# EAGLE design MD201x_2019-02-01 (EAGLE 9.3.0)

## Sheet 1 of 4
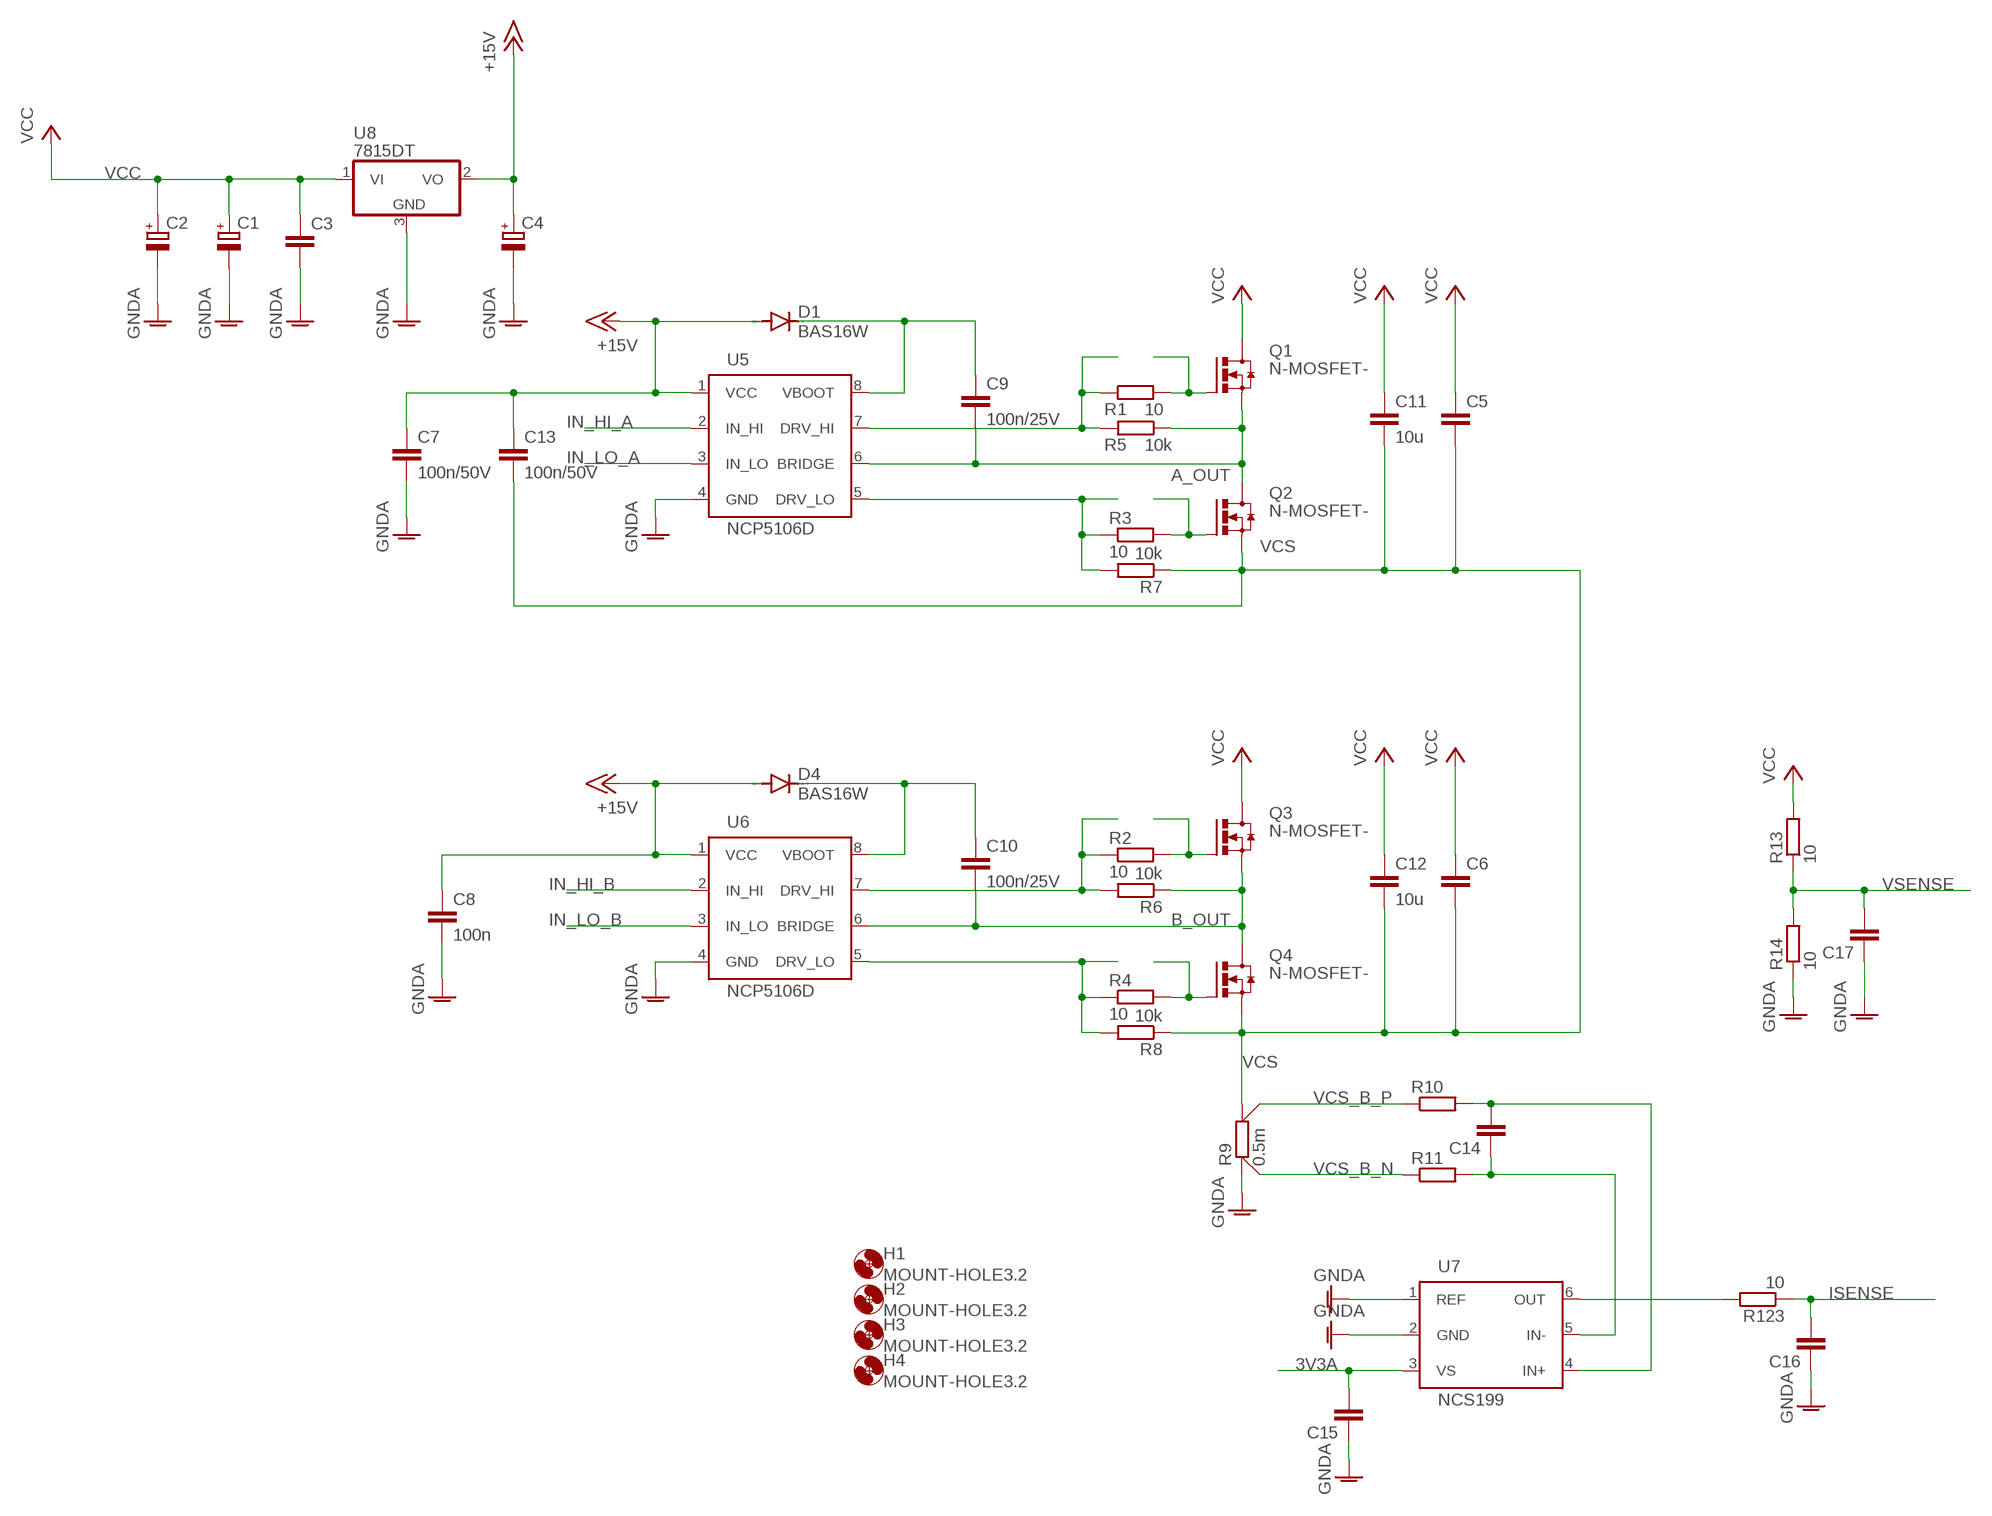
[diagram p0: schematic, sheet 1]

### Parts
C1  CPOL-EUE5-10.5  [E5-10,5]
C2  CPOL-EUE5-10.5  [E5-10,5]
C3  C-EUC0603  [C0603]
C4  CPOL-EUE2.5-5  [E2,5-5]
C5  C-EUC0603  [C0603]
C6  C-EUC0603  [C0603]
C7  100n/50V  C-EUC0603  [C0603]
C8  100n  C-EUC0603  [C0603]
C9  100n/25V  C-EUC0603  [C0603]
C10  100n/25V  C-EUC0603  [C0603]
C11  10u  C-EUC1210  [C1210]
C12  10u  C-EUC1210  [C1210]
C13  100n/50V  C-EUC0603  [C0603]
C14  C-EUC0603  [C0603]
C15  C-EUC0603  [C0603]
C16  C-EUC0603  [C0603]
C17  C-EUC0603  [C0603]
D1  BAS16W  DIODE-SOD323-R  [SOD323-R]
D4  BAS16W  DIODE-SOD323-R  [SOD323-R]
H1  MOUNT-HOLE3.2  [3,2]
H2  MOUNT-HOLE3.2  [3,2]
H3  MOUNT-HOLE3.2  [3,2]
H4  MOUNT-HOLE3.2  [3,2]
Q1  N-MOSFET-  [SOT669]
Q2  N-MOSFET-  [SOT669]
Q3  N-MOSFET-  [SOT669]
Q4  N-MOSFET-  [SOT669]
R1  10  R-EU_R0603  [R0603]
R2  10  R-EU_R0603  [R0603]
R3  10  R-EU_R0603  [R0603]
R4  10  R-EU_R0603  [R0603]
R5  10k  R-EU_R0603  [R0603]
R6  10k  R-EU_R0603  [R0603]
R7  10k  R-EU_R0603  [R0603]
R8  10k  R-EU_R0603  [R0603]
R9  0.5m  CSS2H-2512  [CSS2H-2512]
R10  R-EU_R0603  [R0603]
R11  R-EU_R0603  [R0603]
R13  10  R-EU_R0603  [R0603]
R14  10  R-EU_R0603  [R0603]
R123  10  R-EU_R0603  [R0603]
U5  NCP5106D  [SOIC127P600X175-8]
U6  NCP5106D  [SOIC127P600X175-8]
U7  NCS199  [SOT65P210X110-6]
U8  7815DT  [TO252]

### Nets
3V3A: C15.2 U7.3(VS) ; also sheet 3
+15V: C4.+ C7.1 C8.1 C13.1 D1.A D4.A U5.1(VCC) U6.1(VCC) U8.2(VO) ; also sheet 4
A_OUT: C9.2 Q1.1(SOURCE) Q1.2(SOURCE) Q1.3(SOURCE) Q2.5(DRAIN) R5.1 U5.6(BRIDGE)
B_OUT: C10.2 Q3.1(SOURCE) Q3.2(SOURCE) Q3.3(SOURCE) Q4.5(DRAIN) R6.1 U6.6(BRIDGE)
GNDA: C1.- C2.- C3.2 C4.- C7.2 C8.2 C15.1 C16.1 C17.1 R9.1$1 R9.1$2 R14.1 U5.4(GND) U6.4(GND) U7.1(REF) U7.2(GND) U8.3(GND) ; also sheet 2,3,4
IN_HI_A: U5.2(IN_HI) ; also sheet 3
IN_HI_B: U6.2(IN_HI) ; also sheet 3
IN_LO_A: U5.3(IN_LO) ; also sheet 3
IN_LO_B: U6.3(IN_LO) ; also sheet 3
ISENSE: C16.2 R123.1 ; also sheet 3
N$1: R1.1 R5.2 U5.7(DRV_HI)
N$2: R2.1 R6.2 U6.7(DRV_HI)
N$4: Q1.4(GATE) R1.2
N$5: R4.1 R8.2 U6.5(DRV_LO)
N$6: R123.2 U7.6(OUT)
N$11: R3.1 R7.2 U5.5(DRV_LO)
N$13: Q3.4(GATE) R2.2
N$36: C14.2 R10.2 U7.4(IN+)
N$37: C14.1 R11.2 U7.5(IN-)
N$61: Q2.4(GATE) R3.2
N$64: Q4.4(GATE) R4.2
N$67: C10.1 D4.C U6.8(VBOOT)
N$73: C9.1 D1.C U5.8(VBOOT)
VCC: C1.+ C2.+ C3.1 C5.1 C6.1 C11.1 C12.1 Q1.5(DRAIN) Q3.5(DRAIN) R13.2 U8.1(VI)
VCS: C5.2 C6.2 C11.2 C12.2 C13.2 Q2.1(SOURCE) Q2.2(SOURCE) Q2.3(SOURCE) Q4.1(SOURCE) Q4.2(SOURCE) Q4.3(SOURCE) R7.1 R8.1 R9.2$1 R9.2$2
VCS_B_N: R9.1S R11.1
VCS_B_P: R9.2S R10.1
VSENSE: C17.2 R13.1 R14.2 ; also sheet 3

## Sheet 2 of 4
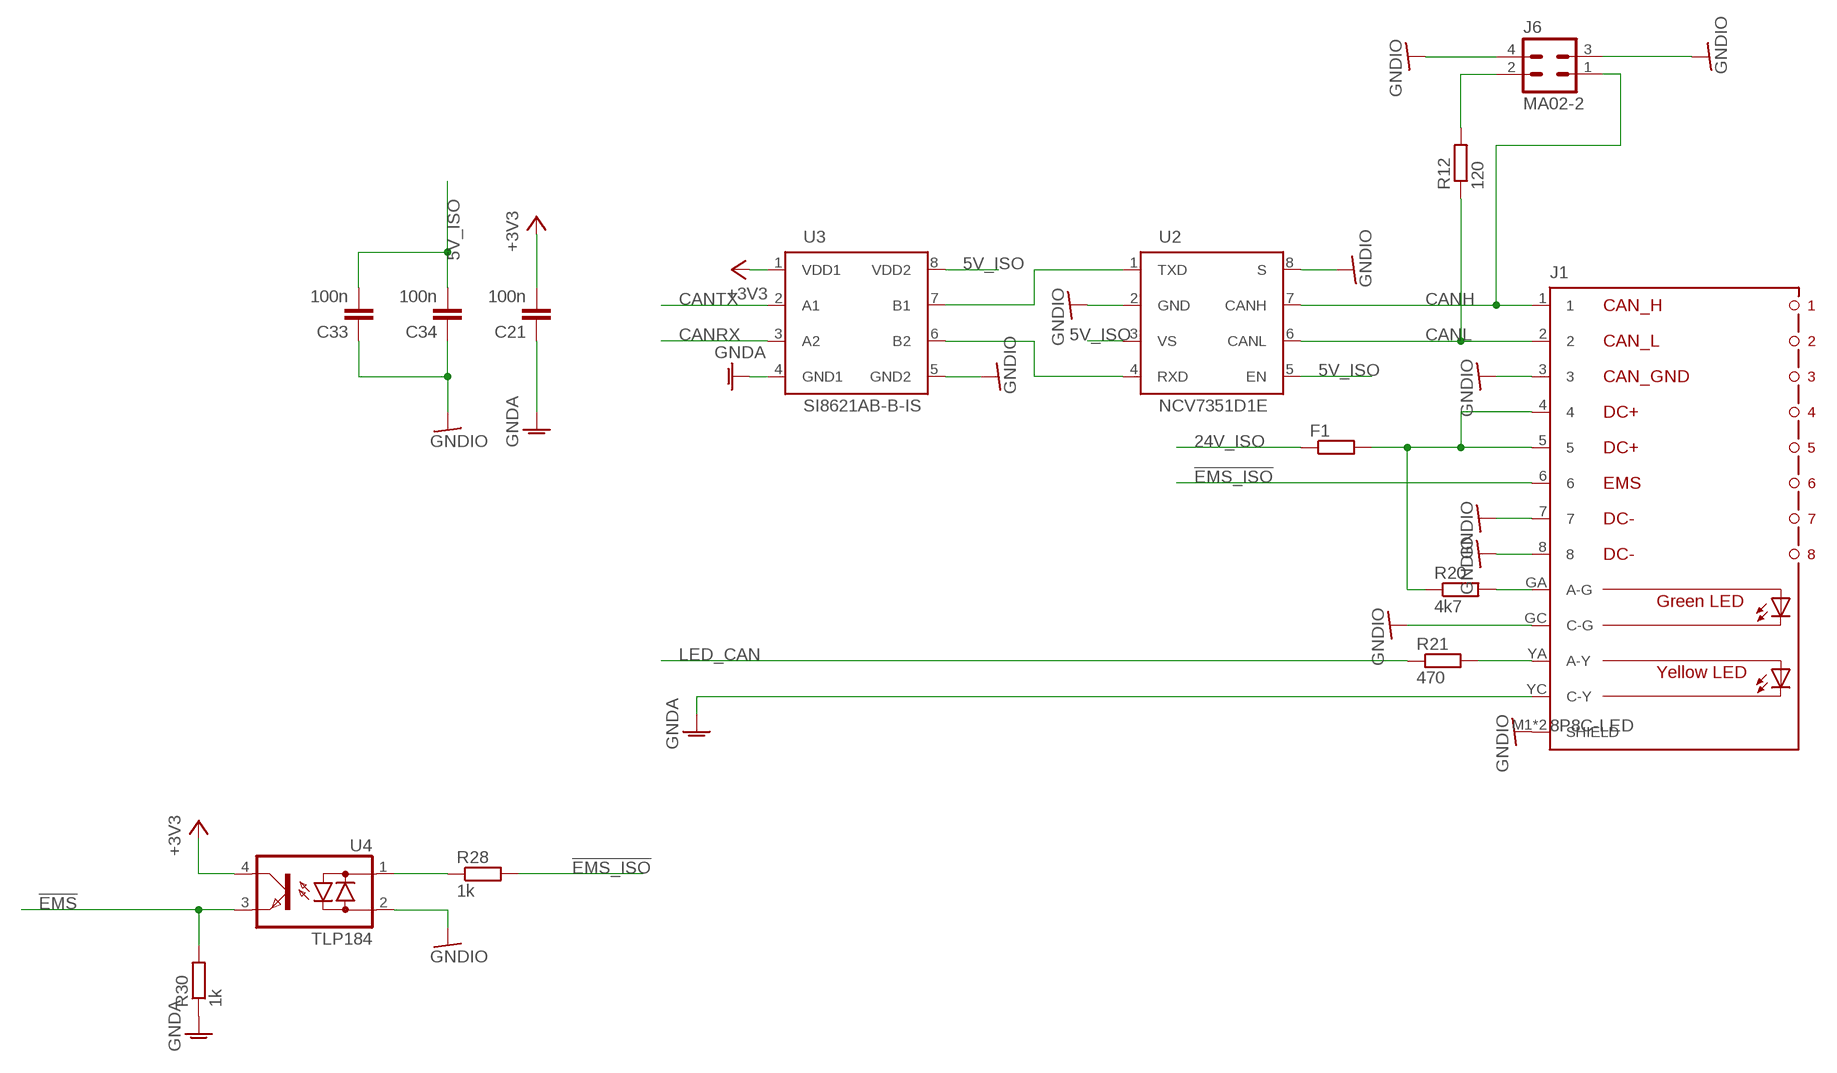
[diagram p1: schematic, sheet 2]

### Parts
C21  100n  C-EUC0603  [C0603]
C33  100n  C-EUC0805  [C0805]
C34  100n  C-EUC0603  [C0603]
F1  R-EU_R1206  [R1206]
J1  8P8C-LED  [8P8C-LED]
J6  MA02-2  [MA02-2W]
R12  120  R-EU_R0603  [R0603]
R20  4k7  R-EU_R0603  [R0603]
R21  470  R-EU_R0603  [R0603]
R28  1k  R-EU_R0603  [R0603]
R30  1k  R-EU_R0603  [R0603]
U2  NCV7351D1E  [SO08]
U3  SI8621AB-B-IS  [SO08]
U4  TLP184  [11-4M1S]

### Nets
5V_ISO: C33.2 C34.2 U2.3(VS) U2.5(EN) U3.8(VDD2) ; also sheet 4
24V_ISO: F1.1 ; also sheet 4
!EMS: R30.2 U4.3(E) ; also sheet 3
!EMS_ISO: J1.6 R28.2
+3V3: C21.2 U3.1(VDD1) U4.4(C) ; also sheet 3,4
CANH: J1.1 J6.1 U2.7(CANH)
CANL: J1.2 R12.1 U2.6(CANL)
CANRX: U3.3(A2) ; also sheet 3
CANTX: U3.2(A1) ; also sheet 3
GNDA: C21.1 J1.YC(C-Y) R30.1 U3.4(GND1) ; also sheet 1,3,4
GNDIO: C33.1 C34.1 J1.3 J1.7 J1.8 J1.GC(C-G) J1.M1(SHIELD) J1.M2(SHIELD) J6.3 J6.4 U2.2(GND) U2.8(S) U3.5(GND2) U4.2(AC2) ; also sheet 4
LED_CAN: R21.1 ; also sheet 3
N$8: F1.2 J1.4 J1.5 R20.1
N$9: J6.2 R12.2
N$18: J1.GA(A-G) R20.2
N$20: J1.YA(A-Y) R21.2
N$23: U2.1(TXD) U3.7(B1)
N$27: U2.4(RXD) U3.6(B2)
N$30: R28.1 U4.1(AC1)

## Sheet 3 of 4
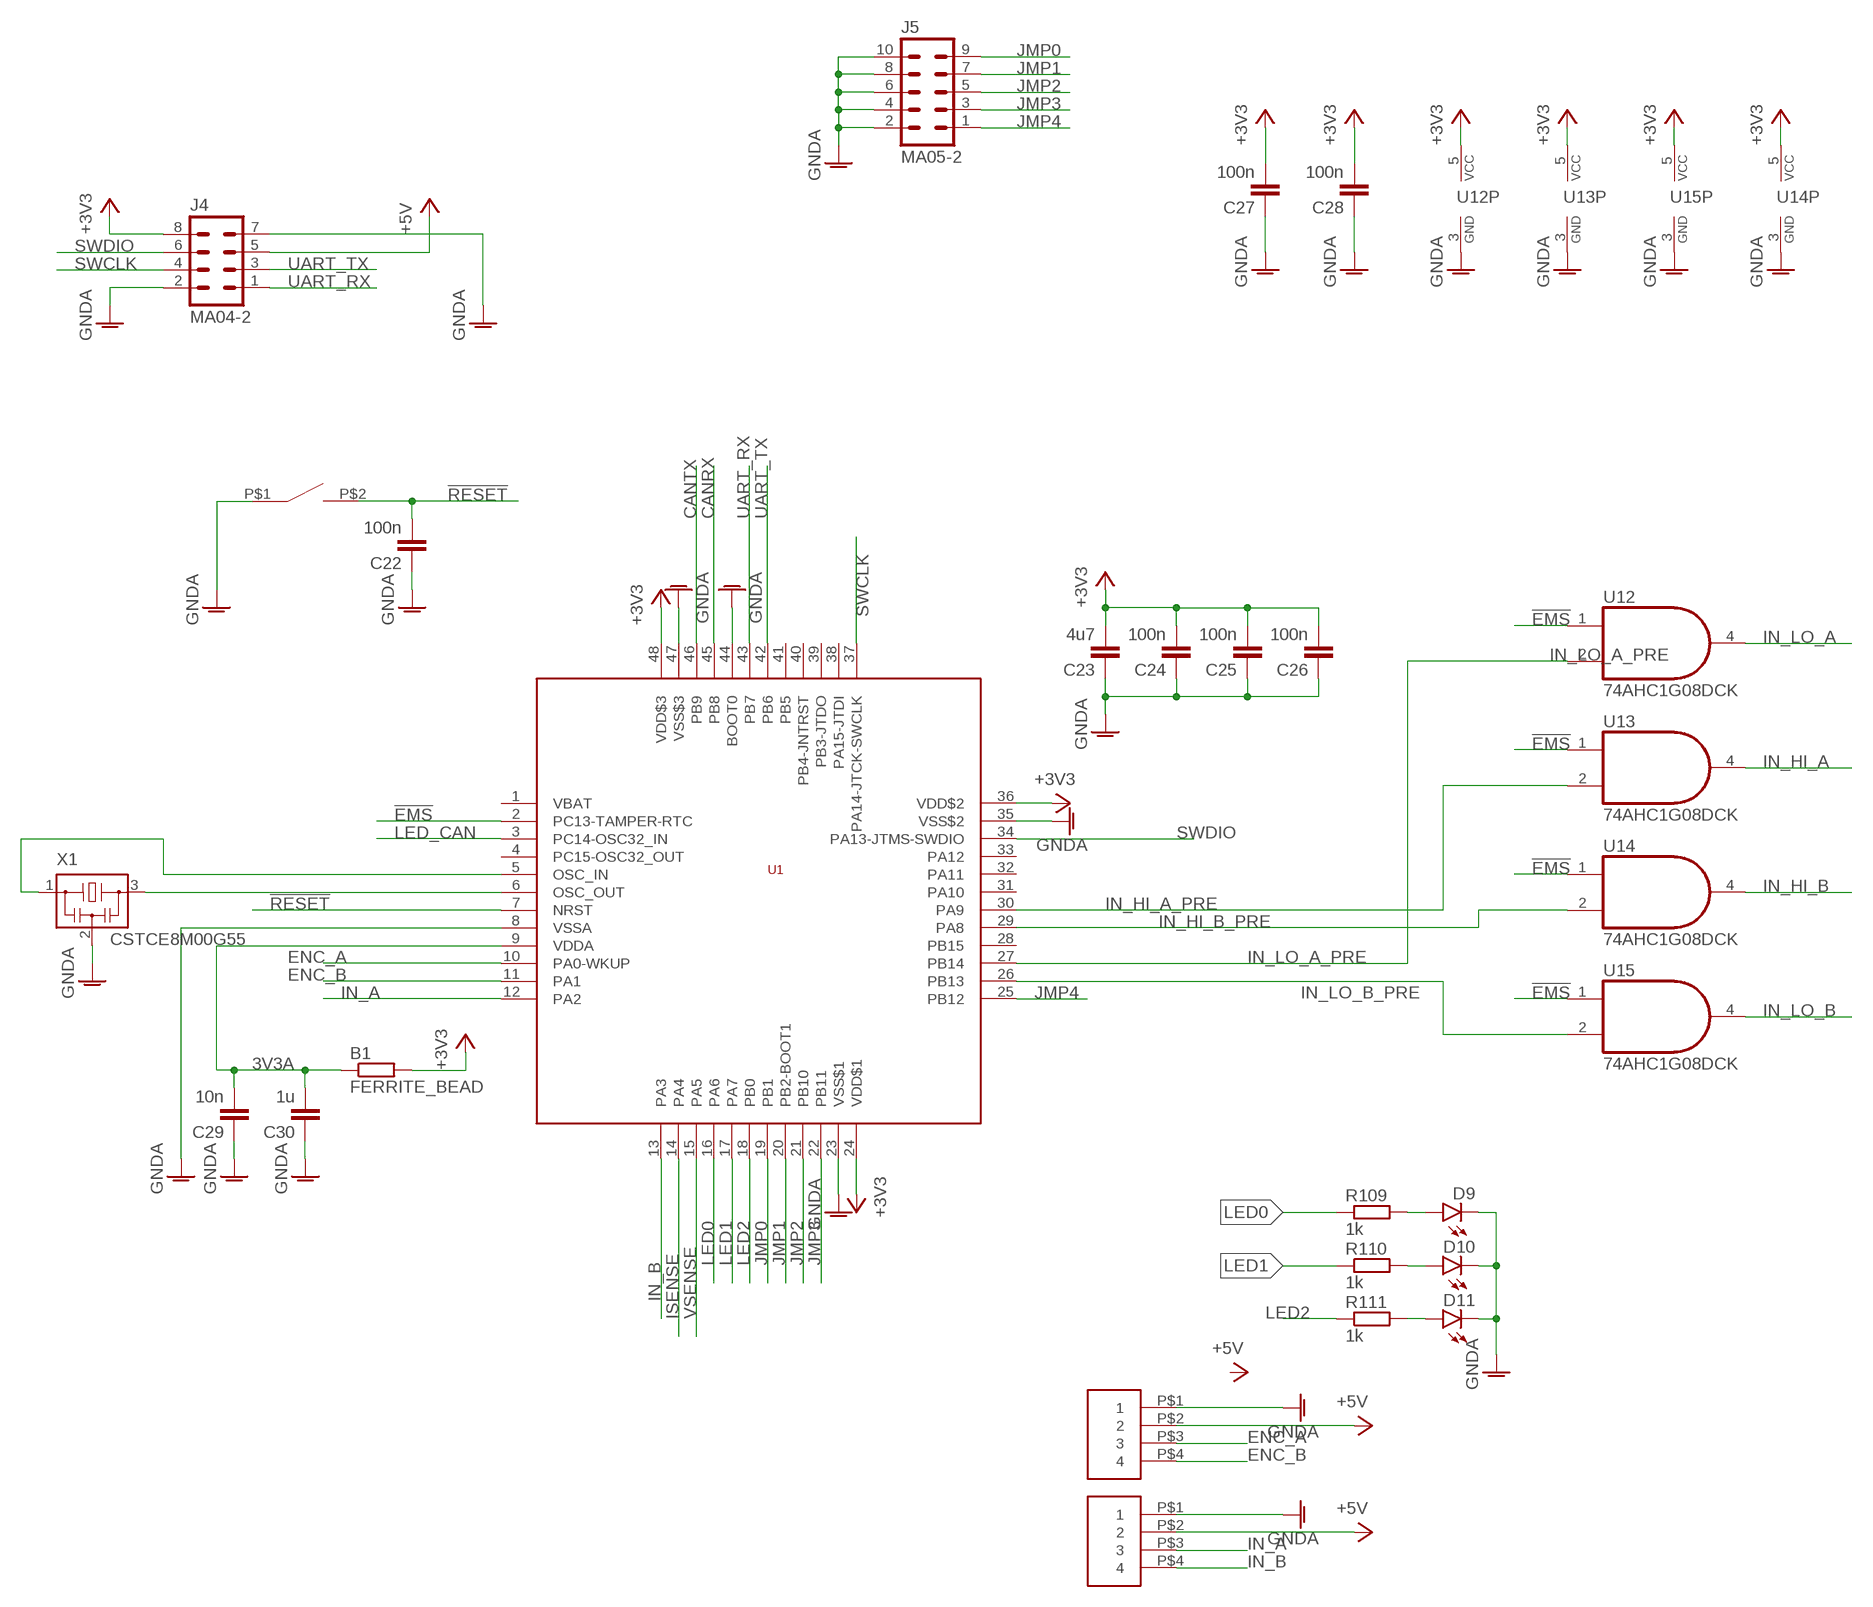
[diagram p2: schematic, sheet 3]

### Parts
B1  FERRITE_BEAD  R-EU_R0603  [R0603]
C22  100n  C-EUC0603  [C0603]
C23  4u7  C-EUC0805  [C0805]
C24  100n  C-EUC0603  [C0603]
C25  100n  C-EUC0603  [C0603]
C26  100n  C-EUC0603  [C0603]
C27  100n  C-EUC0603  [C0603]
C28  100n  C-EUC0603  [C0603]
C29  10n  C-EUC0603  [C0603]
C30  1u  C-EUC0603  [C0603]
D9  LEDCHIPLED_0805  [CHIPLED_0805]
D10  LEDCHIPLED_0805  [CHIPLED_0805]
D11  LEDCHIPLED_0805  [CHIPLED_0805]
J2  XH-4-SIDE  [CON-XH-4-SIDE]
J3  XH-4-SIDE  [CON-XH-4-SIDE]
J4  MA04-2  [MA04-2W]
J5  MA05-2  [MA05-2W]
R109  1k  R-EU_R0603  [R0603]
R110  1k  R-EU_R0603  [R0603]
R111  1k  R-EU_R0603  [R0603]
S1  SWITCH_TACTILETOP  [SWITCH_TACTILE_3X6]
U1  STM32F103C8  [LQFP48]
U12  74AHC1G08DCK  [SC70-5]
U13  74AHC1G08DCK  [SC70-5]
U14  74AHC1G08DCK  [SC70-5]
U15  74AHC1G08DCK  [SC70-5]
X1  CSTCE8M00G55  [CSTCE8M00G55]

### Nets
3V3A: B1.1 C29.2 C30.2 U1.9(VDDA) ; also sheet 1
!EMS: U1.2(PC13-TAMPER-RTC) U12.1(I0) U13.1(I0) U14.1(I0) U15.1(I0) ; also sheet 2
!RESET: C22.2 S1.P$2 U1.7(NRST)
+3V3: B1.2 C23.2 C24.2 C25.2 C26.2 C27.2 C28.2 J4.8 U1.24(VDD$1) U1.36(VDD$2) U1.48(VDD$3) U12.5(VCC) U13.5(VCC) U14.5(VCC) U15.5(VCC) ; also sheet 2,4
+5V: J2.P$2 J3.P$2 J4.5 ; also sheet 4
CANRX: U1.45(PB8) ; also sheet 2
CANTX: U1.46(PB9) ; also sheet 2
ENC_A: J2.P$3 U1.10(PA0-WKUP)
ENC_B: J2.P$4 U1.11(PA1)
GNDA: C22.1 C23.1 C24.1 C25.1 C26.1 C27.1 C28.1 C29.1 C30.1 D9.C D10.C D11.C J2.P$1 J3.P$1 J4.2 J4.7 J5.2 J5.4 J5.6 J5.8 J5.10 S1.P$1 U1.8(VSSA) U1.23(VSS$1) U1.35(VSS$2) U1.44(BOOT0) U1.47(VSS$3) U12.3(GND) U13.3(GND) U14.3(GND) U15.3(GND) X1.2 ; also sheet 1,2,4
IN_A: J3.P$3 U1.12(PA2)
IN_B: J3.P$4 U1.13(PA3)
IN_HI_A: U13.4(O) ; also sheet 1
IN_HI_A_PRE: U1.30(PA9) U13.2(I1)
IN_HI_B: U14.4(O) ; also sheet 1
IN_HI_B_PRE: U1.29(PA8) U14.2(I1)
IN_LO_A: U12.4(O) ; also sheet 1
IN_LO_A_PRE: U1.27(PB14) U12.2(I1)
IN_LO_B: U15.4(O) ; also sheet 1
IN_LO_B_PRE: U1.26(PB13) U15.2(I1)
ISENSE: U1.14(PA4) ; also sheet 1
JMP0: J5.9 U1.19(PB1)
JMP1: J5.7 U1.20(PB2-BOOT1)
JMP2: J5.5 U1.21(PB10)
JMP3: J5.3 U1.22(PB11)
JMP4: J5.1 U1.25(PB12)
LED0: R109.1 U1.16(PA6)
LED1: R110.1 U1.17(PA7)
LED2: R111.1 U1.18(PB0)
LED_CAN: U1.3(PC14-OSC32_IN) ; also sheet 2
N$3: D10.A R110.2
N$7: D9.A R109.2
N$10: U1.6(OSC_OUT) X1.3
N$19: U1.5(OSC_IN) X1.1
N$21: D11.A R111.2
SWCLK: J4.4 U1.37(PA14-JTCK-SWCLK)
SWDIO: J4.6 U1.34(PA13-JTMS-SWDIO)
UART_RX: J4.1 U1.43(PB7)
UART_TX: J4.3 U1.42(PB6)
VSENSE: U1.15(PA5) ; also sheet 1
Unconnected: U1.1(VBAT) U1.4(PC15-OSC32_OUT) U1.28(PB15) U1.31(PA10) U1.32(PA11) U1.33(PA12) U1.38(PA15-JTDI) U1.39(PB3-JTDO) U1.40(PB4-JNTRST) U1.41(PB5)

## Sheet 4 of 4
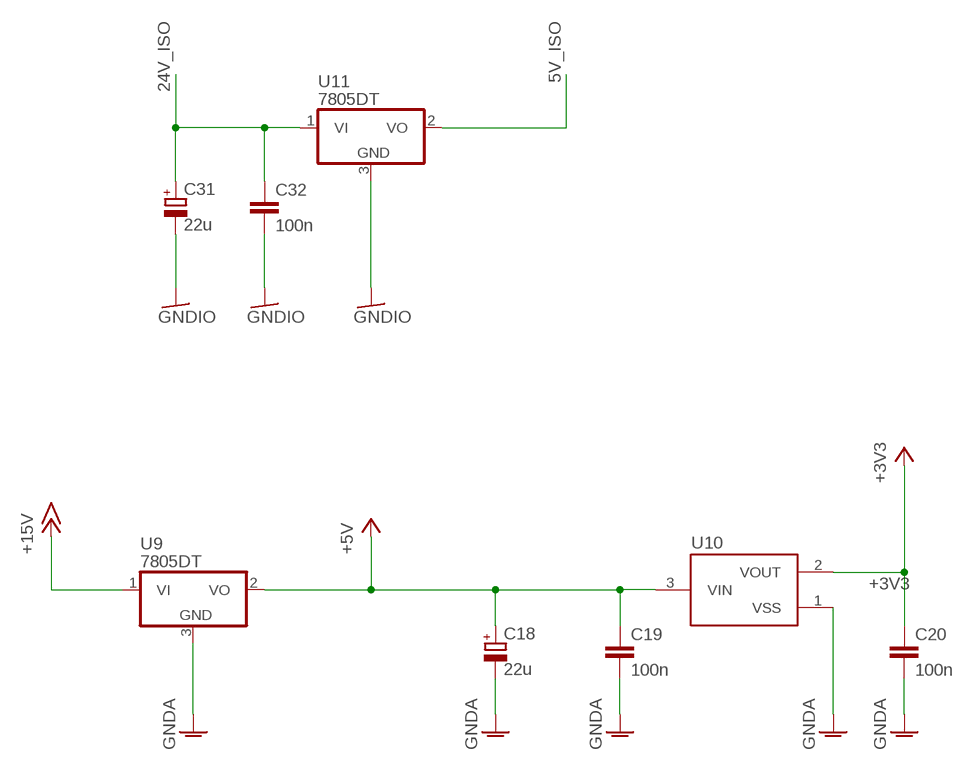
[diagram p3: schematic, sheet 4]

### Parts
C18  22u  CPOL-EUE2.5-5  [E2,5-5]
C19  100n  C-EUC0603  [C0603]
C20  100n  C-EUC0603  [C0603]
C31  22u  CPOL-EUE2.5-5  [E2,5-5]
C32  100n  C-EUC0603  [C0603]
U9  7805DT  [TO252]
U10  XC6206  [SOT95P240X110-3]
U11  7805DT  [TO252]

### Nets
5V_ISO: U11.2(VO) ; also sheet 2
24V_ISO: C31.+ C32.1 U11.1(VI) ; also sheet 2
+3V3: C20.1 U10.2(VOUT) ; also sheet 2,3
+5V: C18.+ C19.1 U9.2(VO) U10.3(VIN) ; also sheet 3
+15V: U9.1(VI) ; also sheet 1
GNDA: C18.- C19.2 C20.2 U9.3(GND) U10.1(VSS) ; also sheet 1,2,3
GNDIO: C31.- C32.2 U11.3(GND) ; also sheet 2

## Library data of the parts
B1 R1-R8 R13 R14 R109-R111 R123 = rcl:R-EU_: RESISTOR, European symbol
C1 C2 C4 C18 C31 = rcl:CPOL-EU: POLARIZED CAPACITOR, European symbol
C3 C5-C13 C19-C30 C32-C34 = rcl:C-EU: CAPACITOR, European symbol
C14-C17 = rcl:C-EU: CAPACITOR, European symbol; SPICEPREFIX: C
D1 D4 = diode:DIODE-: DIODE
D9-D11 = led:LED: LED OSRAM: - CHIPLED LG R971, LG N971, LY N971, LG Q971, LY Q971, LO R971, LY R971 LH N974, LH R974 LS Q976, LO Q976, LY Q976 LO Q996 - Hyper CHIPLED LW Q18S LB Q993, LB Q99A, LB R99A - SideLED LS A670, LO A670, LY A670, LG A670, LP A670 LB A673, LV A673, LT A673, LW A673 LH A674 LY A675 LS A676, LA A676, LO A676, LY A676, LW A676 LS A679, LY A679, LG A679 - Hyper Micro SIDELED® LS Y876, LA Y876, LO Y876, LY Y876 LT Y87S - SmartLED LW L88C, LW L88S LB L89C, LB L89S, LG L890 LS L89K, LO L89K, LY L89K LS L896, LA L896, LO L896, LY L896 - TOPLED LS T670, LO T670, LY T670, LG T670, LP T670 LSG T670, LSP T670, LSY T670, LOP T670, LYG T670 LG T671, LOG T671, LSG T671 LB T673, LV T673, LT T673, LW T673 LH T674 LS T676, LA T676, LO T676, LY T676, LB T676, LH T676, LSB T676, LW T676 LB T67C, LV T67C, LT T67C, LS T67K, LO T67K, LY T67K, LW E67C LS E67B, LA E67B, LO E67B, LY E67B, LB E67C, LV E67C, LT E67C LW T67C LS T679, LY T679, LG T679 LS T770, LO T770, LY T770, LG T770, LP T770 LB T773, LV T773, LT T773, LW T773 LH T774 LS E675, LA E675, LY E675, LS T675 LS T776, LA T776, LO T776, LY T776, LB T776 LHGB T686 LT T68C, LB T68C - Hyper Mini TOPLED® LB M676 - Mini TOPLED Santana® LG M470 LS M47K, LO M47K, LY M47K Source: http://www.osram.convergy.de LUXEON: - LUMILED® LXK2-PW12-R00, LXK2-PW12-S00, LXK2-PW14-U00, LXK2-PW14-V00 LXK2-PM12-R00, LXK2-PM12-S00, LXK2-PM14-U00 LXK2-PE12-Q00, LXK2-PE12-R00, LXK2-PE12-S00, LXK2-PE14-T00, LXK2-PE14-U00 LXK2-PB12-K00, LXK2-PB12-L00, LXK2-PB12-M00, LXK2-PB14-N00, LXK2-PB14-P00, LXK2-PB14-Q00 LXK2-PR12-L00, LXK2-PR12-M00, LXK2-PR14-Q00, LXK2-PR14-R00 LXK2-PD12-Q00, LXK2-PD12-R00, LXK2-PD12-S00 LXK2-PH12-R00, LXK2-PH12-S00 LXK2-PL12-P00, LXK2-PL12-Q00, LXK2-PL12-R00 Source: www.luxeon.com KINGBRIGHT: KA-3528ASYC Source: www.kingbright.com
F1 R10-R12 R20 R21 R28 R30 = rcl:R-EU_: RESISTOR, European symbol; SPICEPREFIX: R
H1-H4 = holes:MOUNT-HOLE: MOUNTING HOLE with drill center marker
J1 = con-rj45:8P8C-LED: generic 8P8C connector with two LED's; OC_FARNELL: unknown; OC_NEWARK: unknown
J2 J3 = con-xh:XH-4-SIDE
J4 = con-headers:MA04-2
J5 = con-headers:MA05-2
J6 = con-headers:MA02-2
Q1-Q4 = nexperia:N-MOSFET-*
R9 = r_shunt:CSS2H-2512: Bourns Model CSS2H-2512 Series Current Sense Resistor <https://www.bourns.com/docs/Product-Datasheets/css2h-2512.pdf>
S1 = switch-tactile:SWITCH_TACTILE
U1 = stm32_mcu:STM32F103C8: STMicroelectronics STM32F103C8 Mainstream Performance line, ARM Cortex-M3 MCU with 64 Kbytes Flash, 72 MHz CPU, motor control, USB and CAN references: datasheet <https://www.st.com/resource/en/datasheet/stm32f103c8.pdf> product page <https://www.st.com/ja/microcontrollers/stm32f103c8.html>
U2 = on-semi:NCV7351D1E: High Speed CAN Transceiver Source: NCV7351-D.PDF <http://www.onsemi.com/PowerSolutions/document/NCV7351-D.PDF>
U3 = silabs:SI8621AB-B-IS: 1 Mbps Digital Isolator 1 Mbps, 2.5 kVRMS Digital Isolator Source: Si86xx.pdf <https://www.silabs.com/documents/public/data-sheets/Si86xx.pdf>
U4 = md201x:TLP184
U5 U6 = on-semi:NCP5106
U7 = on-semi:NCS199
U8 U9 U11 = linear:78*: Positive VOLTAGE REGULATOR Source: http://cache.national.com/ds/LM/LM78L05.pdf http://www.fairchildsemi.com/ds/LM/LM7805.pdf
U10 = torex:XC6206
U12-U15 = 74xx-little-us:74*1G08: 2-input AND gate
X1 = resonator:CSTCE8M00G55

## Net classes
1 current_sense: width 0.254 mm

## Board
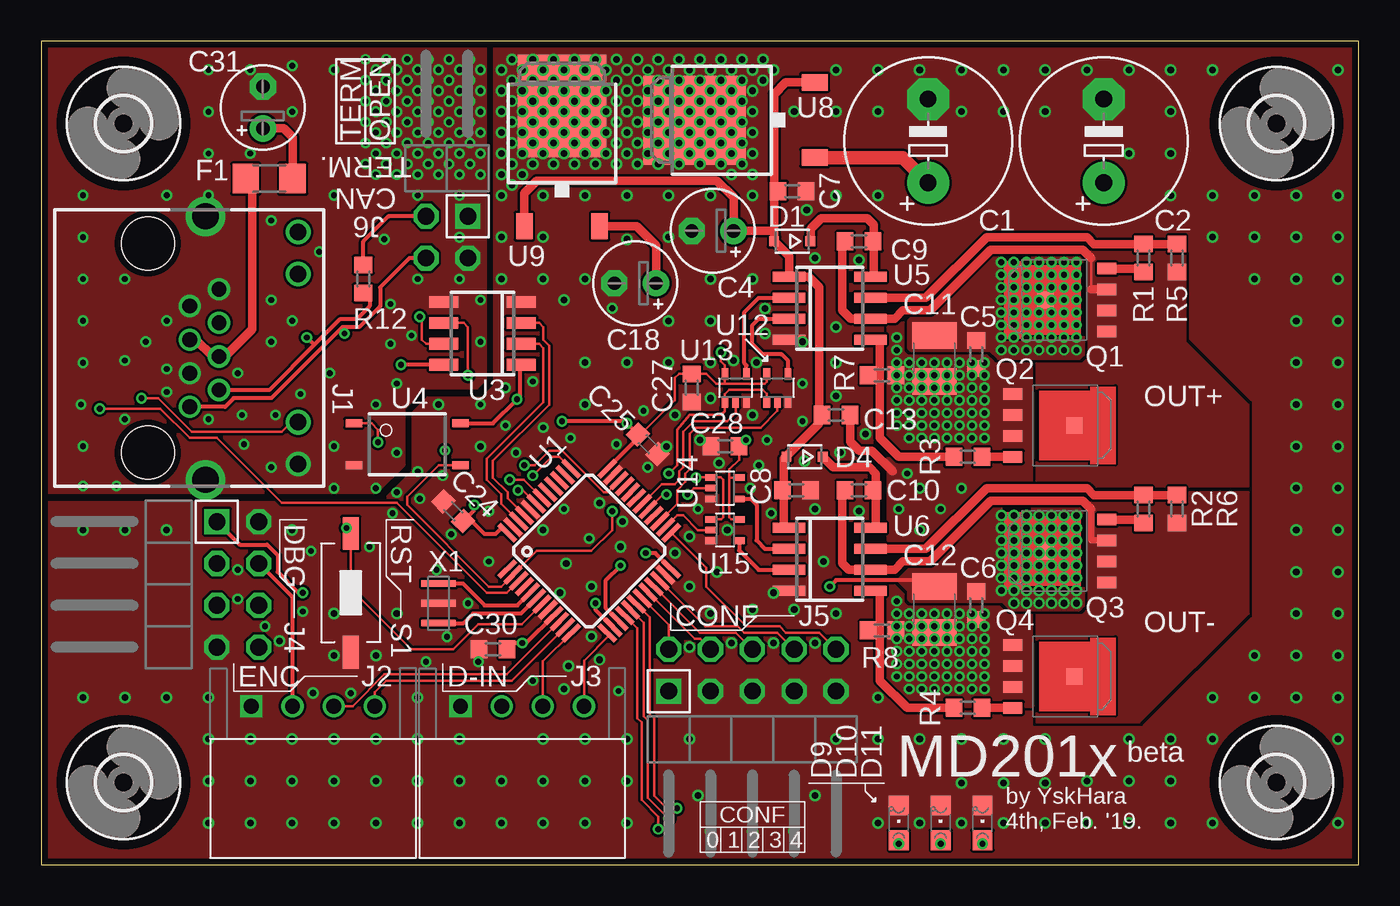
[diagram p4: board, top side]
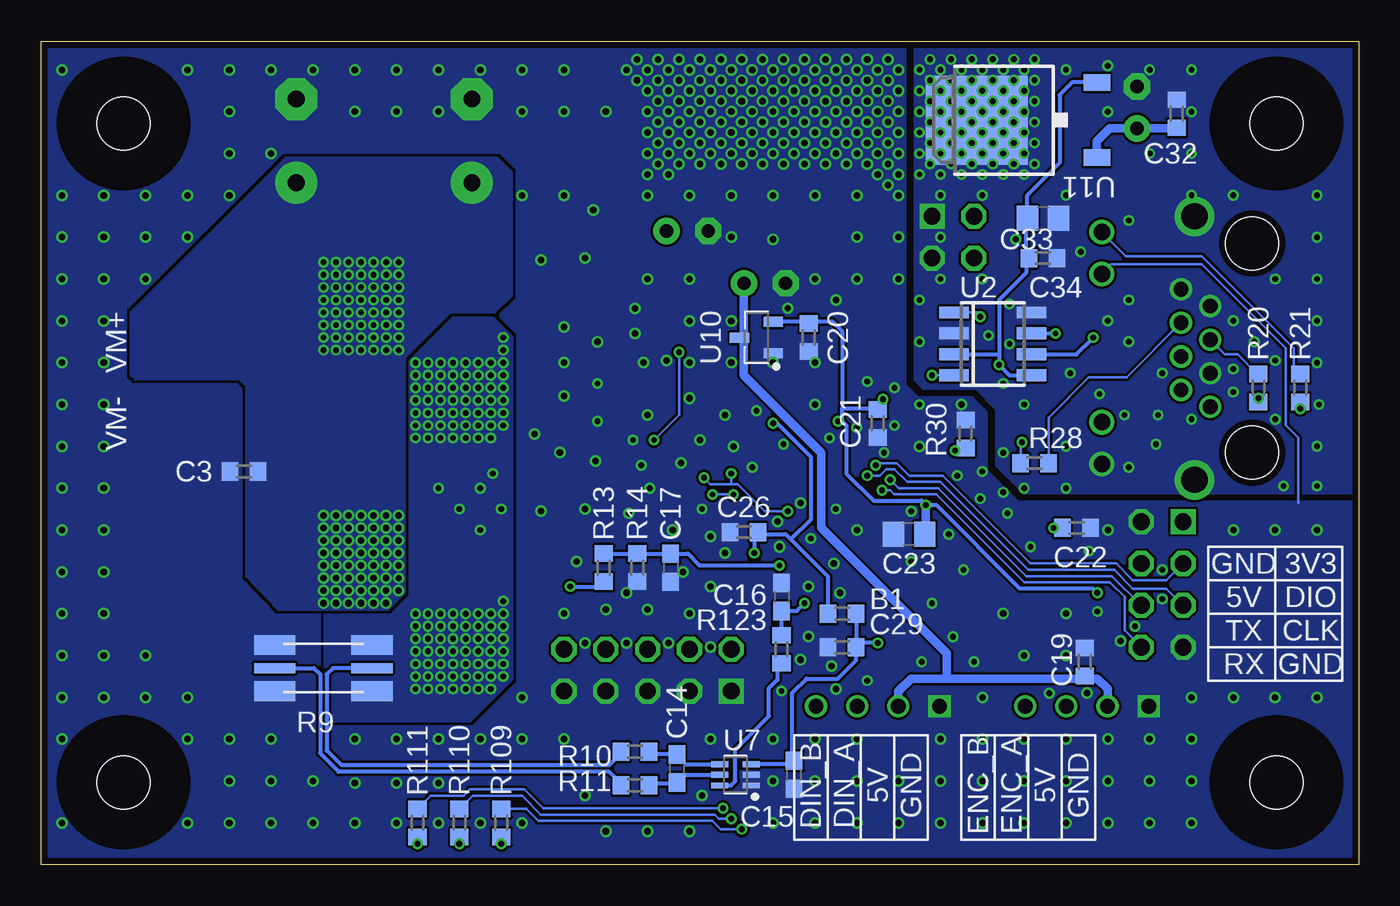
[diagram p5: board, bottom side, seen from below]

Size 80 x 50 mm. Coordinates in mm from the lower left corner, seen from the top.
Outline: 0,0 80,0 80,50 0,50 0,0
Copper layers (1*16): Top 0.035mm / dielectric 1.5mm / Bottom 0.035mm
Design rules "seeed_2layers": minimum track width 6mil, minimum drill 0.2mm, track to track 6mil, track to pad 6mil, pad to pad 6mil, via to via 6mil, smd to smd 0mil, copper to edge 0.4mm, drill to drill 12mil, minimum pad ring 0.15mm, minimum via ring 0.15mm, stop-mask expansion 4mil, vias tented up to drill 50mil, thermal gap 10mil
tKeepout: 11 lines
bKeepout: 6 lines
tRestrict: 2 lines

### Footprints (pad centres in the part's own frame; a part is rotated, then mirrored left to right if it is on the bottom)
R0603 = smd 1 x 1.1: 1 -0.85,0; 2 0.85,0
E5-10,5 = drill 1.016 pad 2.54: + -2.54,0 | drill 1.016 pad 2.54 octagon: - 2.54,0
C0603 = smd 1 x 1.1: 1 -0.85,0; 2 0.85,0
E2,5-5 = drill 0.813 pad 1.6: + -1.27,0 | drill 0.813 pad 1.6 octagon: - 1.27,0
C1210 = smd 1.6 x 2.7: 1 -1.4,0; 2 1.4,0
C0603' = smd 1.1 x 1: 1 -0.85,0; 2 0.85,0
C0805 = smd 1.3 x 1.5: 1 -0.95,0; 2 0.95,0
SOD323-R = smd 0.6 x 0.6: A 1.1,0; C -1.1,0
CHIPLED_0805 = smd 1.2 x 1.2: A 0,-1.05; C 0,1.05
R1206 = smd 1.6 x 1.803: 1 -1.422,0; 2 1.422,0
3,2 = hole 3.2: 0,0
8P8C-LED = drill 0.9 pad 1.3: 1 3.57,-3.81; 2 2.55,-2.03; 3 1.53,-3.81; 4 0.51,-2.03; 5 -0.51,-3.81; 6 -1.53,-2.03; 7 -2.55,-3.81; 8 -3.57,-2.03 | drill 1 pad 1.422: GA 4.5,2.78; GC 7.04,2.78; YA -7.04,2.78; YC -4.5,2.78 | drill 1.6 pad 2.184: M1 -8,-2.85; M2 8,-2.85 | hole 3.2: 6.35,-6.35; -6.35,-6.35
CON-XH-4-SIDE = drill 0.9 square: P$1 3.75,-2 | drill 0.9: P$2 1.25,-2; P$3 -1.25,-2; P$4 -3.75,-2
MA04-2W = drill 1.016 octagon: 1 -3.81,-1.27; 2 -3.81,1.27; 3 -1.27,-1.27; 4 -1.27,1.27; 5 1.27,-1.27; 6 1.27,1.27; 7 3.81,-1.27 | drill 1.016 square: 8 3.81,1.27
MA05-2W = drill 1.016 octagon: 1 -5.08,-1.27; 2 -5.08,1.27; 3 -2.54,-1.27; 4 -2.54,1.27; 5 0,-1.27; 6 0,1.27; 7 2.54,-1.27; 8 2.54,1.27; 9 5.08,-1.27 | drill 1.016 square: 10 5.08,1.27
MA02-2W = drill 1.016 octagon: 1 -1.27,-1.27; 2 -1.27,1.27; 3 1.27,-1.27 | drill 1.016 square: 4 1.27,1.27
SOT669 = smd 1.15 x 0.7: 1 -2.725,1.905; 2 -2.725,0.635; 3 -2.725,-0.635; 4 -2.725,-1.905 | smd 1 x 1: 5 1,0
CSS2H-2512 = smd 2.5 x 1.2: 1$1 -2.95,1.4; 1$2 -2.95,-1.4; 2$1 2.95,1.4; 2$2 2.95,-1.4 | smd 2.5 x 0.6: 1S -2.95,0; 2S 2.95,0
SWITCH_TACTILE_3X6 = smd 2 x 1: P$1 -3.6,0; P$2 3.6,0
LQFP48 = smd 1.4 x 0.3: 1 -4.3,2.75; 2 -4.3,2.25; 3 -4.3,1.75; 4 -4.3,1.25; 5 -4.3,0.75; 6 -4.3,0.25; 7 -4.3,-0.25; 8 -4.3,-0.75; 9 -4.3,-1.25; 10 -4.3,-1.75; 11 -4.3,-2.25; 12 -4.3,-2.75; 25 4.3,-2.75; 26 4.3,-2.25; 27 4.3,-1.75; 28 4.3,-1.25; 29 4.3,-0.75; 30 4.3,-0.25; 31 4.3,0.25; 32 4.3,0.75; 33 4.3,1.25; 34 4.3,1.75; 35 4.3,2.25; 36 4.3,2.75 | smd 0.3 x 1.4: 13 -2.75,-4.3; 14 -2.25,-4.3; 15 -1.75,-4.3; 16 -1.25,-4.3; 17 -0.75,-4.3; 18 -0.25,-4.3; 19 0.25,-4.3; 20 0.75,-4.3; 21 1.25,-4.3; 22 1.75,-4.3; 23 2.25,-4.3; 24 2.75,-4.3; 37 2.75,4.3; 38 2.25,4.3; 39 1.75,4.3; 40 1.25,4.3; 41 0.75,4.3; 42 0.25,4.3; 43 -0.25,4.3; 44 -0.75,4.3; 45 -1.25,4.3; 46 -1.75,4.3; 47 -2.25,4.3; 48 -2.75,4.3
SO08 = smd 0.72 x 1.78: 1 -1.905,-2.35; 2 -0.635,-2.35; 3 0.635,-2.35; 4 1.905,-2.35; 5 1.905,2.35; 6 0.635,2.35; 7 -0.635,2.35; 8 -1.905,2.35
11-4M1S = smd 1 x 0.5: 1 -3.24,1.27; 2 -3.24,-1.27; 3 3.24,-1.27; 4 3.24,1.27
SOIC127P600X175-8 = smd 1.968 x 0.602: 1 -2.473,1.905; 2 -2.473,0.635; 3 -2.473,-0.635; 4 -2.473,-1.905; 5 2.473,-1.905; 6 2.473,-0.635; 7 2.473,0.635; 8 2.473,1.905
SOT65P210X110-6 = smd 1.02 x 0.36: 1 -0.955,0.65; 2 -0.955,0; 3 -0.955,-0.65; 4 0.955,-0.65; 5 0.955,0; 6 0.955,0.65
TO252 = smd 1 x 1.6: 1 -2.28,-4.8; 2 2.28,-4.8 | smd 5.4 x 6.2: 3 0,2.5
SOT95P240X110-3 = smd 1.18 x 0.609: 1 -1.024,0.95; 2 -1.024,-0.95; 3 1.024,0
SC70-5 = smd 0.4 x 0.7: 1 -0.65,-0.85; 2 0,-0.85; 3 0.65,-0.85; 4 0.65,0.85; 5 -0.65,0.85
CSTCE8M00G55 = smd 0.4 x 2.1: 1 -1.2,0; 2 0,0; 3 1.2,0

### Placement (x,y rotation side)
B1  31.37,15.24 180 bottom
C1  53.85,43.94 90 top
C2  64.52,43.94 90 top
C3  67.69,23.88 180 bottom
C4  40.77,38.48 180 top
C5  56.77,30.99 270 top
C6  56.77,15.75 270 top
C7  45.59,40.89 0 top
C8  45.85,22.73 0 top
C9  49.66,37.85 180 top
C10  49.66,22.73 180 top
C11  54.23,30.73 270 top
C12  54.23,15.49 270 top
C13  48.26,27.3 0 top
C14  [C0603']  41.4,5.84 90 bottom
C15  [C0603']  34.29,5.46 90 bottom
C16  [C0603']  35.05,16.26 270 bottom
C17  [C0603']  41.78,18.03 90 bottom
C18  36.07,35.31 180 top
C19  16.64,12.32 90 bottom
C20  33.4,32 270 bottom
C21  29.21,26.8 90 bottom
C22  17.14,20.45 180 bottom
C23  27.3,20.07 0 bottom
C24  25.02,21.46 315 top
C25  36.83,25.53 135 top
C26  37.34,20.19 0 bottom
C27  39.5,28.96 90 top
C28  41.53,25.4 0 top
C29  31.37,13.21 0 bottom
C30  27.43,13.08 0 top
C31  13.46,45.97 90 top
C32  11.05,45.59 90 bottom
C33  19.18,39.24 180 bottom
C34  19.18,36.83 180 bottom
D1  45.59,37.85 180 top
D4  46.35,24.77 180 top
D9  52.07,2.54 0 top
D10  54.61,2.54 0 top
D11  57.15,2.54 0 top
F1  13.84,41.66 180 top
H1  75,45 0 top
H2  75,5 0 top
H3  5,45 0 top
H4  5,5 0 top
J1  12.83,31.37 270 top
J2  16.51,7.62 180 top
J3  29.21,7.62 180 top
J4  11.94,17.02 90 top
J5  43.18,11.81 180 top
J6  24.64,38.1 0 top
Q1  61.98,34.29 180 top
Q2  61.72,26.67 0 top
Q3  61.98,19.05 180 top
Q4  61.72,11.43 0 top
R1  66.93,36.83 270 top
R2  66.93,21.59 270 top
R3  56.26,24.77 0 top
R4  56.26,9.53 0 top
R5  68.96,36.83 90 top
R6  68.96,21.59 90 top
R7  51.05,29.72 180 top
R8  51.05,14.22 180 top
R9  62.87,11.94 0 bottom
R10  43.94,6.86 0 bottom
R11  43.94,4.83 0 bottom
R12  19.56,35.56 90 top
R13  45.85,18.03 270 bottom
R14  43.81,18.03 90 bottom
R20  6.1,28.96 270 bottom
R21  3.56,28.96 90 bottom
R28  19.68,24.38 0 bottom
R30  23.88,26.16 270 bottom
R109  52.07,2.54 270 bottom
R110  54.61,2.54 270 bottom
R111  57.15,2.54 270 bottom
R123  35.05,13.08 270 bottom
S1  18.8,16.51 90 top
U1  33.27,19.05 45 top
U2  22.23,31.62 270 bottom
U3  26.8,32.26 90 top
U4  22.23,25.53 0 top
U5  47.88,33.78 0 top
U6  47.88,18.54 0 top
U7  37.85,5.46 180 bottom
U8  42.16,45.21 90 top
U9  31.62,43.56 0 top
U10  36.58,32 180 bottom
U11  20.7,45.21 90 bottom
U12  44.7,28.96 0 top
U13  42.16,28.96 0 top
U14  41.53,22.86 270 top
U15  41.53,20.32 270 top
X1  24.13,15.88 270 top

### Tracks (layer width: path | path; a pad name or v marks a point on that pad's centre or on a via)
3V3A  (via drill 0.35)
  Top 0.254: U1.9 29.45,13.46 v29.21,13.46 28.66,13.46 C30.2
  Bottom 0.254: v29.21,13.46 30.52,13.46 C29.2 | C15.2 34.29,6.11 34.42,6.11 | 34.42,6.11 U7.3 | 34.42,6.11 34.42,10.41 33.53,11.3 31.62,11.3 30.52,12.41 C29.2 | B1.1 C29.2
5V_ISO  (via drill 0.35)
  Top 0.254: U3.8 v21.84,30.35
  Bottom 0.254: U11.2 17.41,47.49 18.16,46.74 18.16,42.61 20.13,40.64 C33.2 20.19,39.31 20.19,36.83 | 20.19,36.83 C34.2 20.07,36.79 | U2.5 21.21,29.72 v21.84,30.35 21.84,30.99 | U2.3 21.84,30.99 | 20.19,36.83 20.19,35.94 21.84,34.29 21.84,30.99
24V_ISO
  Top 0.508: F1.1 15.27,44.17 14.73,44.7 C31.+
  Bottom 0.508: U11.1 15.9,43.92 15.11,44.7 C31.+ 11.09,44.7 C32.1
!EMS  (via drill 0.35)
  Top 0.152: U4.3 24.51,24.26 | 24.51,24.26 24.13,24.26 22.23,22.35 22.23,21.84 27.18,16.89 27.93,16.89 U1.2 30.09,19.05 33.4,19.05 34.67,20.32 v34.67,21.46 | v24.51,25.15 24.51,24.26 | U15.1 41.29,20.97 41.4,21.08 41.4,23.37 41.26,23.51 U14.1 39.77,23.51 v39.75,23.5 | U12.1 44.05,28.59 43.81,28.83 41.78,28.83 41.51,28.56 U13.1 41.51,27.54 41.27,27.3 39.37,27.3 38.61,26.42 38.61,24.26 v38.1,23.75
  Bottom 0.152: R30.2 24.04,25.15 v24.51,25.15 | v39.75,23.5 39.37,23.11 38.1,23.11 | 38.1,23.11 37.72,23.11 36.07,21.46 v34.67,21.46 | v38.1,23.75 38.1,23.11
!EMS_ISO
  Bottom 0.152: R28.2 18.84,27.14 16.38,29.59 14.11,29.59 J1.6
!RESET  (via drill 0.35)
  Top 0.152: U1.7 29.18,14.61 26.54,14.61 25.02,13.08 22.48,13.08 18.8,16.76 S1.P$2
  Top 0.254: S1.P$2 18.8,20.19 v18.54,20.45
  Bottom 0.254: C22.2 v18.54,20.45
+3V3  (via drill 0.35)
  Top 0.152: U12.5 44.05,29.32 43.94,29.21 41.51,29.21 | 41.51,29.21 U13.5 41.51,30.31 41.27,30.55 v41.27,31.11 | C25.2 36.41,26.13 38.48,28.19 38.48,29.55 38.73,29.81 C27.2 40.39,29.81 40.98,29.21 41.51,29.21 | U15.5 41.9,20.97 41.78,21.08 41.78,23.5 | 41.78,23.5 41.78,24 42.38,24.6 C28.2 42.76,25.78 v42.8,25.78 | U14.5 42.36,23.5 41.78,23.5
  Top 0.254: U1.24 37.29,18.92 v36.7,18.92 | J4.8 12.06,19.43 13.72,19.43 14.35,18.8 14.35,17.78 15.62,16.51 v15.88,16.51 | U4.4 27.43,26.8 v28.89,28.26 29.08,28.45 29.08,30.35 U3.1 | C25.2 36.23,25.89 U1.36 | v26.29,21.84 26.29,21.53 C24.2 26.13,20.86 26.92,20.07 27.57,20.07 27.97,20.46 U1.48 | C25.2 v35.56,26.8 35.43,26.92 v31.62,26.92 | C25.2 36.41,26.13
  Bottom 0.152: v42.8,25.78 41.27,27.3 v41.27,31.11
  Bottom 0.254: v15.88,16.51 16.13,16.76 20.57,16.76 25.65,21.84 v26.29,21.84 26.54,22.1 29.46,22.1 31.11,23.75 31.11,26.67 31.37,26.92 | v36.7,18.92 36.7,20.19 C26.2 36.36,20.07 34.8,20.07 34.48,19.75 | B1.2 32.22,17.49 34.48,19.75 | 34.48,19.75 33.27,20.95 33.27,24.77 35.31,26.8 v35.56,26.8 | v28.89,28.26 29.21,27.94 C21.2 29.25,27.69 31.37,27.69 | C20.1 33.4,32.95 | 33.4,32.95 U10.2 | 31.37,26.92 31.37,27.69 | 33.4,32.95 31.94,32.95 31.37,32.38 31.37,27.69 | v31.62,26.92 31.37,26.92
  Bottom 0.508: v26.29,21.84 26.29,20.13 C23.2
+5V
  Top 0.254: J4.5 15.24,16.26 15.24,9.64 J2.P$2
  Top 0.508: U9.2 36.17,38.76 37.34,37.59 C18.+
  Bottom 0.508: 37.34,32 37.34,29.72 32.64,25.02 32.64,20.45 25.02,12.83 25.02,11.3 | C18.+ 37.34,32 | U10.3 37.34,32 | 25.02,11.3 27.18,11.3 27.96,10.52 J3.P$2 | 25.02,11.3 16.64,11.3 | 16.64,11.3 15.88,11.3 15.24,10.67 15.24,9.64 J2.P$2 | C19.1 16.64,11.3
+15V
  Top 0.508: 45.09,22.73 45.09,20.45 U6.1 | C8.1 45.09,22.73 | 45.09,22.73 45.09,24.64 | D4.A 45.13,24.64 45.09,24.64 | 45.09,24.64 47.24,26.8 47.24,27.3 | 47.24,27.3 47.24,35.05 46.61,35.69 U5.1 45.41,36.93 D1.A | U9.1 29.34,40.77 30.1,41.53 41.02,41.53 42.04,40.51 C4.+ 44.49,38.48 D1.A | U8.2 45.21,47.49 44.49,46.78 44.49,40.89 C7.1 44.49,40.74 D1.A | C13.1 47.24,27.3
A_OUT
  Top 0.152: 63.75,36.83 63.75,34.92
  Top 0.508: 63.75,36.83 63.25,37.34 57.66,37.34 53.98,33.66 52.32,33.66 51.82,33.15 U5.6 49.15,33.15 48.64,33.66 48.64,37.85 C9.2 | 63.75,34.92 Q1.3
  pour Top (rank 2, no thermals): 63.5,30.86 63.12,30.48 60.45,30.48 60.45,22.99 73.28,22.99 73.28,27.94 69.47,31.75 69.47,37.21 63.37,37.21 63.5,37.08
B_OUT
  Top 0.406: Q3.3 63.75,19.68 63.75,21.59
  Top 0.508: 63.75,21.59 63.25,22.1 57.66,22.1 53.98,18.41 52.32,18.41 51.82,17.91 U6.6 49.02,17.91 48.64,18.29 48.64,22.73 C10.2
  pour Top (rank 3, no thermals): 73.28,22.61 65.66,22.61 65.02,21.97 63.37,21.97 63.5,21.84 63.5,15.75 62.99,15.24 60.45,15.24 60.45,8.64 66.67,8.64 73.28,15.24
CANH  (via drill 0.35)
  Top 0.254: J6.1 22.35,36.83 20.57,35.05 20.57,33.91 19.3,32.64 18.29,32.64 18.16,32.51 | 18.16,32.51 13.97,28.32 11.68,28.32 11.16,27.8 J1.1 | v18.41,32.26 18.16,32.51
  Bottom 0.254: U2.7 v18.41,32.26
CANL  (via drill 0.35)
  Top 0.254: 16.57,31.56 13.83,28.82 J1.2 | v16.13,32 16.57,31.56 | 16.57,31.56 18.16,33.15 19.18,33.15 19.94,33.91 19.94,34.71 R12.1
  Bottom 0.254: U2.6 17.14,30.99 v16.13,32
CANRX
  Top 0.152: U1.45 28.32,22.23 28.32,22.61 27.43,23.5 27.43,24.51 30.86,27.94 30.86,31.5 30.48,31.88 30.48,32.64 30.23,32.89 U3.3
CANTX
  Top 0.152: U3.2 30.23,31.62 30.48,31.37 30.48,28.07 27.05,24.64 27.05,23.37 27.94,22.48 27.94,21.91 U1.46
ENC_A
  Top 0.152: J2.P$3 18.9,9.62 20.84,11.56 28.26,11.56 U1.10
ENC_B
  Top 0.152: J2.P$4 20.26,10.48 20.95,11.18 28.58,11.18 U1.11
GNDA  (via drill 0.35, 0.4)
  Bottom 0.152: J1.YC 15.03,36.45 9.53,36.45 4.45,31.37 4.45,26.67 3.68,25.91 3.68,21.97
  other vias: 78.74,10.16 78.74,12.7 78.74,15.24 78.74,17.78 78.74,20.32 78.74,22.86 78.74,25.4 78.74,27.94 78.74,30.48 78.74,33.02 78.74,35.56 78.74,38.1 78.74,40.64 78.74,7.62 18.8,10.41 33.27,19.81 26.67,27.94 28.19,28.96 46.23,29.21 44.32,21.34 44.07,25.78 34.67,33.78 24.64,13.84 23.37,12.32 76.2,25.4 76.2,27.94 76.2,30.48 76.2,33.02 76.2,35.56 76.2,38.1 76.2,40.64 76.2,22.86 76.2,20.32 76.2,17.78 76.2,15.24 76.2,12.7 76.2,10.16 73.66,10.16 73.66,12.7 71.12,10.16 71.12,7.62 68.58,7.62 68.58,2.54 71.12,2.54 78.74,2.54 66.04,7.62 66.04,2.54 63.5,2.54 63.5,5.08 60.96,7.62 60.96,2.54 58.42,2.54 55.88,2.54 53.34,2.54 50.8,2.54 50.8,10.16 39.37,7.62 38.48,18.92 48.51,25.02 48.26,28.45 48.26,30.48 35.56,2.54 35.56,5.08 33.02,5.08 33.02,7.62 30.48,7.62 30.48,5.08 30.48,2.54 33.02,2.54 27.94,2.54 27.94,5.08 25.4,5.08 25.4,2.54 22.86,2.54 22.86,5.08 20.32,5.08 20.32,2.54 17.78,2.54 17.78,5.08 15.24,5.08 15.24,2.54 12.7,2.54 12.7,5.08 10.16,5.08 10.16,2.54 10.16,7.62 10.16,10.16 7.62,10.16 16.51,10.41 25.4,7.62 22.86,7.62 20.32,7.62 22.86,10.16 17.78,7.62 5.08,10.16 2.54,10.16 40.64,33.02 38.1,33.02 27.94,35.56 27.94,38.1 38.1,45.72 38.1,44.45 43.18,43.18 43.18,48.26 40.64,48.26 48.26,48.26 50.8,45.72 55.88,45.72 55.88,48.26 53.34,48.26 50.8,48.26 58.42,48.26 58.42,45.72 60.96,45.72 60.96,48.26 63.5,48.26 66.04,48.26 68.58,48.26 71.12,48.26 68.58,45.72 68.58,43.18 66.04,43.18 68.58,40.64 71.12,40.64 73.66,40.64 73.66,38.1 71.12,38.1 73.66,35.56 78.74,48.26 44.45,16.51 46.99,21.59 46.99,36.83 46.48,39.75 48.26,40.64 50.8,40.64 38.1,30.48 46.23,31.75 33.91,12.45 46.23,26.92 47.5,18.41 48.26,15.24 35.56,7.62 31.75,10.67 39.37,19.94 29.84,29.34 28.19,26.67 31.75,21.59 27.18,21.46 22.99,22.23 24.38,23.62 22.86,23.88 30.48,26.54 24,17.91 21.59,22.61 35.05,10.54 25.91,15.88 27.18,18.41 24.89,20.07 32.13,25.91 34.92,25.53 28.83,25.02 43.56,24.26 43.05,22.86 39.88,21.59 36.83,24.13 35.31,20.83 36.58,27.56 33.91,21.97 26.54,12.32 16.38,19.05 19.94,19.3 15.88,15.37 29.84,11.18 31.88,18.29 35.18,19.3 33.4,16.89 33.4,13.84 40.64,2.03 43.18,2.03 45.72,2.03 39.88,4.19 58.42,7.62 55.88,7.62 53.34,7.62 50.8,7.62 48.26,7.62 45.72,15.49 43.18,15.49 40.64,15.24 40.64,30.48 38.48,27.3 37.97,25.4 33.02,27.94 33.02,30.48 35.56,30.48 38.1,38.1 33.02,40.64 30.48,40.64 30.48,38.1 27.94,40.64 30.48,35.56 35.56,40.64 38.1,40.64 33.02,43.18 27.94,43.18 30.48,43.18 43.18,27.3 40.01,25.78 46.99,4.19 66.04,5.08 68.58,5.08 60.96,4.95 58.42,4.95 55.88,4.95 50.04,26.16 46.35,24.51 40.64,40.64 17.78,12.7 17.78,15.24 21.59,15.24 20.32,12.7 30.48,20.32 33.02,35.56 40.64,35.56 43.18,35.56 43.18,40.64 40.64,43.18 38.1,43.18 35.56,43.18 32,12.06 31.5,16.51 11.94,17.91 11.94,16.13 7.62,20.32 5.08,20.32 2.54,20.32 13.59,14.48 39.37,16.89 43.94,33.78 49.66,36.7 49.66,21.46 14.48,13.59 35.56,37.97 48.26,45.72 45.72,45.72 43.18,45.72 40.64,45.72 38.1,48.26 35.56,48.26 35.56,46.99 35.56,45.72 35.56,44.45 36.83,43.18 36.83,44.45 36.83,45.72 36.83,46.99 36.83,48.26 38.1,46.99 39.37,48.26 39.37,46.99 39.37,45.72 39.37,44.45 39.37,43.18 40.64,44.45 41.91,43.18 41.91,44.45 43.18,44.45 41.91,45.72 40.64,46.99 41.91,46.99 43.18,46.99 41.91,48.26 44.45,48.26 43.18,41.91 34.29,43.18 34.29,44.45 34.29,45.72 34.29,46.99 34.29,48.26 33.02,48.26 33.02,46.99 33.02,45.72 33.02,44.45 31.75,43.18 31.75,44.45 31.75,45.72 31.75,46.99 31.75,48.26 30.48,48.26 30.48,46.99 30.48,45.72 30.48,44.45 29.21,43.18 29.21,44.45 29.21,45.72 29.21,46.99 27.94,44.45 27.94,45.72 27.94,46.99 27.94,48.26 29.21,48.26 27.94,41.91 29.21,41.91 24.13,27.94 26.67,25.4 15.24,7.62 12.7,7.62 41.15,24.38 40.64,28.32 43.43,30.48 42.04,30.61 15.24,20.32 28.57,47.62 29.84,47.62 29.84,46.35 28.57,46.35 28.57,45.09 29.84,45.09 29.84,43.81 28.57,43.81 31.11,43.81 31.11,45.09 31.11,46.35 31.11,47.62 32.38,47.62 32.38,46.35 32.38,45.09 32.38,43.81 29.84,42.55 28.57,42.55 31.11,42.55 32.38,42.55 33.66,42.55 34.92,42.55 33.66,43.81 33.66,45.09 33.66,46.35 33.66,47.62 34.92,47.62 34.92,46.35 34.92,45.09 34.92,43.81 29.84,48.9 31.11,48.9 32.38,48.9 28.57,48.9 33.66,48.9 34.92,48.9 36.2,48.9 36.2,47.62 36.2,46.35 36.2,45.09 36.2,43.81 36.2,42.55 37.47,42.55 37.47,43.81 38.73,43.81 38.73,42.55 40.01,42.55 40.01,43.81 41.27,42.55 41.27,43.81 42.55,43.81 42.55,42.55 42.55,45.09 41.27,45.09 40.01,45.09 38.73,45.09 37.47,45.09 38.73,46.35 37.47,46.35 37.47,47.62 38.73,47.62 40.01,47.62 41.27,47.62 42.55,47.62 42.55,46.35 41.27,46.35 40.01,46.35 37.47,48.9 38.73,48.9 40.01,48.9 41.27,48.9 42.55,48.9 43.81,47.62 43.81,48.9 28.57,41.27 41.91,41.91 21.34,21.34 31.75,34.29 41.66,20.32 41.02,17.78 46.99,13.46 44.45,13.46 41.91,13.46 39.37,13.21 48.26,32.64 43.94,32.26
  pour Top (rank 6, no thermals): 0,0 0,21.97 20.7,21.97 22.61,23.88 22.61,27.43 23.5,28.32 26.8,28.32 27.56,29.08 27.56,49.79 79.88,49.66 79.88,0
  pour Bottom (rank 6, no thermals): 27.56,49.91 79.88,49.91 79.88,0 0,0 0,21.97 20.7,21.97 22.61,23.88 22.61,27.43 23.5,28.32 26.8,28.32 27.56,29.08
GNDIO  (via drill 0.35)
  other vias: 21.59,25.02 11.94,29.84 14.22,27.3 17.53,29.84 17.78,25.4 13.97,31.75 15.75,28.57 12.19,27.3 22.48,32.13 12.32,25.53 2.54,22.99 2.54,25.4 2.41,27.94 5.08,27.05 7.62,28.7 10.16,27.05 7.62,30.1 5.08,30.61 2.54,30.48 2.54,33.02 13.97,34.29 15.24,33.02 2.54,35.56 2.54,38.1 2.54,40.64 7.62,40.64 10.16,40.64 10.16,43.18 10.16,45.72 17.78,48.26 12.7,48.26 10.16,48.26 15.24,48.51 25.4,48.26 25.4,40.64 25.4,38.1 17.78,22.86 25.4,35.56 22.86,35.56 17.78,40.64 7.62,33.02 12.7,43.18 20.32,48.26 22.86,48.26 25.4,45.72 25.4,43.18 22.86,43.18 20.32,43.18 20.32,45.72 22.86,45.72 15.24,45.72 20.32,22.86 20.32,27.94 21.21,31.62 26.67,31.75 26.67,34.29 4.57,22.99 16.89,37.21 13.97,39.12 13.97,24.13 21.59,29.21 21.21,34.04 22.86,40.64 6.35,31.75 5.08,35.56 20.83,37.97 24.13,48.26 25.4,46.99 22.86,46.99 24.13,45.72 24.13,46.99 25.4,44.45 24.13,44.45 22.86,44.45 24.13,43.18 25.4,41.91 22.86,41.91 24.13,41.91 21.59,41.91 20.32,41.91 21.59,43.18 21.59,44.45 21.59,45.72 20.32,44.45 21.59,46.99 20.32,46.99 21.59,48.26 20.95,48.9 22.23,48.9 23.5,48.9 24.77,48.9 26.04,48.9 26.04,47.62 26.04,46.35 26.04,45.09 26.04,43.81 26.04,42.55 26.67,43.18 26.67,44.45 26.67,45.72 26.67,46.99 26.67,48.26 24.77,46.35 24.77,47.62 23.5,47.62 23.5,46.35 23.5,45.09 22.23,47.62 22.23,46.35 20.95,47.62 20.95,46.35 20.95,45.09 22.23,45.09 22.23,43.81 20.95,43.81 20.95,42.55 22.23,42.55 23.5,42.55 24.77,42.55 24.77,43.81 23.5,43.81 24.77,45.09 26.67,41.91 19.68,42.55 19.68,43.81 19.68,45.09 19.68,46.35 19.68,47.62 19.68,48.9
  pour Bottom (rank 5, no thermals): 0,49.91 26.92,49.91 26.92,29.46 26.42,28.96 23.24,28.96 21.97,27.69 21.97,24.26 20.32,22.61 0,22.61
  pour Top (rank 5, no thermals): 0,22.61 0,49.91 26.92,49.91 26.92,29.46 26.42,28.96 23.24,28.96 21.97,27.69 21.97,24.26 20.32,22.61
IN_A
  Top 0.152: J3.P$3 30.46,12.35 U1.12
IN_B
  Top 0.152: J3.P$4 32.96,12.39 34.5,13.93 U1.13
IN_HI_A
  Top 0.254: U13.4 42.81,30.31 42.69,30.44 42.69,33.54 43.56,34.42 U5.2
IN_HI_A_PRE
  Top 0.152: U13.2 42.16,27.43 41.66,26.92 39.62,26.92 38.99,26.29 38.99,24.13 38.73,23.88 38.73,23.37 38.48,23.11 37.69,23.11 U1.30
IN_HI_B
  Top 0.254: U14.4 43.07,22.21 43.43,21.84 43.43,19.68 43.94,19.18 U6.2
IN_HI_B_PRE  (via drill 0.35)
  Top 0.152: U14.2 39.62,22.86 v39.24,22.48 | v37.97,22.48 37.76,22.48 U1.29
  Bottom 0.152: v39.24,22.48 v37.97,22.48
IN_LO_A
  Top 0.254: U12.4 45.35,30.59 44.96,30.99 43.81,30.99 43.18,31.62 43.18,32.77 43.56,33.15 U5.3
IN_LO_A_PRE
  Top 0.152: U12.2 44.7,27.56 43.69,26.54 39.75,26.54 39.37,26.16 39.37,24 39.12,23.75 39.12,23.24 38.61,22.73 38.61,21.91 U1.27
IN_LO_B
  Top 0.254: U15.4 42.38,19.09 43.56,17.91 U6.3
IN_LO_B_PRE
  Top 0.152: U1.26 38.62,21.21 38.99,21.21 39.88,20.32 U15.2
ISENSE  (via drill 0.35)
  Top 0.254: v33.66,15.88 33.66,15.49 U1.14
  Bottom 0.254: R123.1 C16.2 34.12,15.41 v33.66,15.88
JMP0
  Top 0.152: J5.9 38.1,14.58 U1.19
JMP1
  Top 0.152: J5.7 40.01,13.72 39.67,13.72 U1.20
JMP2
  Top 0.152: J5.5 42.16,14.1 39.99,14.1 U1.21
JMP3
  Top 0.152: J5.3 44.7,14.1 42.67,14.1 42.29,14.48 40.32,14.48 U1.22
JMP4
  Top 0.152: J5.1 47.24,14.1 45.21,14.1 44.83,14.48 42.8,14.48 40.39,16.89 40.39,18.02 U1.25
LED0  (via drill 0.35)
  Top 0.152: U1.16 36.2,14.36 36.2,8.89 36.45,8.64 36.45,3.94 37.47,2.92 v37.47,2.16
  Bottom 0.152: R109.1 50.55,3.39 49.82,2.67 39.24,2.67 38.73,2.16 v37.47,2.16
LED1  (via drill 0.35)
  Top 0.152: v38.1,2.79 36.83,4.06 36.83,8.76 36.58,9.02 36.58,14.69 U1.17
  Bottom 0.152: R110.1 53.81,4.19 50.8,4.19 49.66,3.05 39.12,3.05 38.86,2.79 v38.1,2.79
LED2  (via drill 0.35)
  Top 0.152: v38.61,3.43 37.97,3.43 37.21,4.19 37.21,8.89 36.96,9.14 36.96,15.01 U1.18
  Bottom 0.152: R111.1 56.35,4.19 54.36,4.19 53.98,4.57 50.67,4.57 49.53,3.43 v38.61,3.43
LED_CAN  (via drill 0.35)
  Top 0.152: v3.56,27.69 7.24,27.69 9.02,25.91 10.67,25.91 14.61,21.97 21.59,21.97 27.05,16.51 28.26,16.51 U1.3
  Bottom 0.152: v3.56,27.69 R21.1
N$1
  Top 0.508: U5.7 53.72,34.42 57.4,38.1 63.5,38.1 63.92,37.68 R1.1 R5.2
N$2
  Top 0.508: R6.2 R2.1 63.92,22.44 63.5,22.86 57.4,22.86 53.72,19.18 U6.7
N$3  (via drill 0.35)
  Top 0.254: v54.61,1.27 D10.A
  Bottom 0.254: R110.2 v54.61,1.27
N$4
  Top 0.254: 66.67,36.2 66.93,35.94 R1.2 | Q1.4 65.15,36.2
  Top 0.508: 65.15,36.2 66.67,36.2
N$5
  Top 0.508: R4.1 52.58,9.53 50.93,11.18 50.93,14.22 | 50.93,14.22 50.93,16.64 U6.5 | R8.2 50.93,14.22
N$6
  Bottom 0.254: U7.6 38.12,4.81 37.85,5.08 37.85,6.99 35.81,9.02 35.81,10.71 35.31,11.21 35.31,11.98 R123.2
N$7  (via drill 0.35)
  Top 0.254: D9.A v52.07,1.27
  Bottom 0.254: v52.07,1.27 R109.2
N$8
  Top 0.508: F1.2 12.83,41.25 12.83,32.51 11.17,30.86 J1.4 10.42,30.86 9.4,31.88 J1.5
  Bottom 0.152: R20.1 6.18,29.81 7.37,30.99 8.13,30.99 J1.5
N$9
  Top 0.254: J6.2 21.08,39.37 19.56,37.85 R12.2
N$10
  Top 0.254: X1.3 25.65,14.68 26.22,15.24 29.11,15.24 U1.6
N$11
  Top 0.508: 50.93,29.72 R7.2 | U5.5 50.93,31.88 50.93,29.72 | 50.93,29.72 50.93,25.91 52.07,24.77 R3.1
N$13
  Top 0.254: 66.93,20.95 R2.2
  Top 0.508: Q3.4 66.93,20.95
N$18  (via drill 0.35)
  Top 0.152: J1.GA 15.19,26.87 14.61,26.29 9.14,26.29 7.11,28.32 v6.1,28.32
  Bottom 0.152: R20.2 v6.1,28.32
N$19
  Top 0.254: X1.1 25.6,17.07 26.92,15.75 28.91,15.75 U1.5
N$20
  Bottom 0.152: J1.YA 14.15,36.96 9.53,36.96 3.94,31.37 3.94,29.81 R21.2
N$21  (via drill 0.35)
  Top 0.254: D11.A v57.15,1.27
  Bottom 0.254: v57.15,1.27 R111.2
N$23  (via drill 0.35)
  Top 0.152: U3.7 23.37,31.62 23.11,31.88 23.11,33.15 v22.99,33.27
  Bottom 0.152: v22.99,33.27 23.24,33.53 U2.1
N$27  (via drill 0.35)
  Top 0.152: U3.6 25.65,32.89 25.91,32.64 v25.91,29.72
  Bottom 0.152: v25.91,29.72 U2.4
N$30  (via drill 0.35)
  Top 0.152: v20.45,25.65 20.45,26.42 20.07,26.8 U4.1
  Bottom 0.152: R28.1 20.54,25.57 v20.45,25.65
N$36
  Bottom 0.254: C14.2 41.4,6.73 41.53,6.73 | R10.2 42.97,6.73 41.53,6.73 | U7.4 40.91,6.11 41.53,6.73
N$37
  Bottom 0.254: C14.1 41.4,4.95 | R11.2 42.97,4.95 41.4,4.95 | U7.5 40.89,5.46 41.4,4.95
N$61
  Top 0.508: Q2.4 R3.2
N$64
  Top 0.508: R4.2 Q4.4
N$67
  Top 0.508: U6.8 50.67,20.45 50.67,22.73 | C10.1 50.67,22.73 | D4.C 48.09,24.13 50.29,24.13 50.67,23.75 50.67,22.73
N$73
  Top 0.508: C9.1 50.55,37.85 | 50.55,37.85 50.55,35.69 U5.8 | 50.55,37.85 50.55,38.86 50.16,39.24 47.37,39.24 46.74,38.61 46.74,37.85 D1.C
SWCLK  (via drill 0.35)
  Top 0.152: U1.37 31.45,24.77 30.99,24.77 v29.84,23.62
  Bottom 0.152: v29.84,23.62 29.08,23.62 28.7,24 28.19,24 27.43,23.24 25.4,23.24 20.07,17.91 14.86,17.91 13.72,16.76 11.68,16.76 J4.4
SWDIO  (via drill 0.35)
  Top 0.152: U1.34 34.35,22.61 34.16,22.61 31.62,25.15 30.86,25.15 29.97,24.26 v29.34,24.26
  Bottom 0.152: v29.34,24.26 29.21,24.38 28.07,24.38 27.3,23.62 25.27,23.62 19.94,18.29 14.73,18.29 13.72,17.27 11.68,17.27 J4.6
UART_RX  (via drill 0.35)
  Top 0.152: U1.43 29.24,22.73 v28.96,22.73
  Bottom 0.152: v28.96,22.73 28.45,22.73 28.19,22.48 25.65,22.48 20.32,17.14 15.11,17.14 14.22,16.26 14.22,14.22 J4.1
UART_TX  (via drill 0.35)
  Top 0.152: U1.42 29.31,23.37 v28.45,23.37
  Bottom 0.152: v28.45,23.37 27.94,22.86 25.53,22.86 20.19,17.53 14.99,17.53 J4.3
VCC  (via drill 0.35, 0.4)
  Top 0.254: C12.1 53.77,17.27 48.26,17.27 v47.88,16.89
  Top 0.813: U8.1 52.32,42.93 C1.+
  Bottom 0.254: v47.88,16.89 46.14,16.89 R13.2
  other vias: 59.05,21.21 59.05,19.68 61.34,15.88 60.58,15.88 59.82,16.64 58.29,19.68 62.1,15.88 59.05,20.45 58.29,20.45 58.29,21.21 59.05,17.4 59.05,18.92 59.82,17.4 60.58,17.4 59.05,18.16 58.29,18.92 58.29,18.16 58.29,17.4 58.29,16.64 60.58,16.64 59.05,16.64 61.34,16.64 62.1,16.64 62.87,15.88 62.87,16.64 58.29,36.58 58.29,35.81 59.05,36.58 59.05,35.81 58.29,35.05 58.29,34.29 58.29,33.53 58.29,32.77 58.29,32 59.05,32 59.05,32.77 59.82,32 60.58,32 60.58,31.24 61.34,31.24 62.1,31.24 62.87,31.24 61.34,32 62.1,32 62.87,32 62.87,32.77 61.34,32.77 59.82,32.77 60.58,32.77 59.05,33.53 59.82,33.53 60.58,33.53 61.34,33.53 62.1,32.77 62.1,33.53 62.87,33.53 62.1,34.29 62.87,34.29 61.34,34.29 60.58,34.29 59.82,34.29 59.05,34.29 59.05,35.05 59.82,35.05 60.58,35.05 61.34,35.05 62.1,35.05 62.87,35.05 62.87,35.81 62.87,36.58 62.1,36.58 62.1,35.81 61.34,35.81 61.34,36.58 60.58,36.58 60.58,35.81 59.82,35.81 59.82,36.58 61.34,17.4 62.1,17.4 62.87,17.4 62.87,18.16 62.1,18.16 61.34,18.16 60.58,18.16 59.82,18.16 59.82,18.92 60.58,18.92 61.34,18.92 62.1,18.92 62.87,18.92 62.87,19.68 62.1,19.68 61.34,19.68 60.58,19.68 59.82,19.68 59.82,20.45 60.58,20.45 61.34,20.45 62.1,20.45 62.87,20.45 62.87,21.21 62.1,21.21 61.34,21.21 60.58,21.21 59.82,21.21 59.82,15.88 59.05,15.88 59.82,31.24 59.05,31.24 58.29,31.24
  pour Top (no thermals): 57.66,21.84 63.25,21.84 63.25,15.75 62.99,15.49 58.93,15.49 58.42,16 52.83,16 52.7,16.13 52.7,16.64 52.07,17.27 52.83,18.03 53.85,18.03
  pour Top (no thermals): 57.66,37.08 63.25,37.08 63.25,30.99 62.99,30.73 58.17,30.73 57.66,31.24 52.83,31.24 52.7,31.37 52.7,33.02 52.96,33.27 53.85,33.27
  pour Bottom (rank 2, no thermals): 65.6,15.49 58.93,15.49 57.91,16.51 57.91,30.73 55.12,33.53 52.45,33.53 51.44,34.54 51.44,42.04 52.32,42.93 65.15,42.93 74.55,33.53 74.55,29.72 74.3,29.46 67.94,29.46 67.56,29.08 67.56,17.53
VCS  (via drill 0.35)
  Top 0.508: C13.2 49.11,25.69 49.66,25.15 50.42,25.15 51.69,23.88
  other vias: 57.28,30.48 57.28,29.72 56.52,29.72 57.28,28.96 57.28,28.19 57.28,27.43 57.28,26.67 57.28,25.91 56.52,30.48 56.52,28.96 56.52,28.19 56.52,27.43 56.52,26.67 56.52,25.91 55.75,25.91 55.75,26.67 55.75,27.43 55.75,30.48 54.99,30.48 54.23,30.48 53.47,30.48 52.7,30.48 52.7,29.72 53.47,29.72 55.75,28.19 55.75,28.96 55.75,29.72 54.99,29.72 54.23,29.72 54.99,28.96 54.99,28.19 54.99,27.43 54.99,25.91 54.23,25.91 53.47,25.91 52.7,25.91 54.99,26.67 51.94,26.67 51.94,27.43 51.94,28.19 51.94,28.96 51.94,29.72 54.23,28.96 54.23,28.19 54.23,27.43 54.23,26.67 53.47,26.67 53.47,27.43 53.47,28.19 53.47,28.96 52.7,28.96 52.7,28.19 52.7,27.43 52.7,26.67 51.94,30.48 51.94,31.24 51.94,32 57.28,10.67 57.28,11.43 56.52,10.67 56.52,11.43 56.52,12.19 57.28,12.19 55.75,10.67 57.28,12.95 57.28,13.72 57.28,14.48 57.28,15.24 54.99,10.67 54.23,10.67 53.47,10.67 52.7,10.67 52.7,11.43 51.94,11.43 53.47,11.43 54.23,11.43 54.99,11.43 55.75,11.43 51.94,12.19 51.94,12.95 51.94,13.72 51.94,14.48 51.94,15.24 56.52,15.24 55.75,15.24 54.99,15.24 54.23,15.24 53.47,15.24 52.7,15.24 55.75,12.19 54.99,12.19 54.23,12.19 53.47,12.19 52.7,12.19 52.7,12.95 53.47,12.95 54.23,12.95 54.99,12.95 55.75,12.95 56.52,12.95 56.52,13.72 56.52,14.48 55.75,14.48 55.75,13.72 54.99,13.72 54.99,14.48 54.23,14.48 54.23,13.72 53.47,13.72 53.47,14.48 52.7,14.48 52.7,13.72 51.94,16 55.88,22.86 53.34,22.86 53.34,20.32 54.61,21.59 52.58,23.75 52.07,21.59
  pour Top (rank 4, no thermals): 51.44,32.64 51.44,11.3 53.09,9.65 60.2,9.65 60.2,30.73 59.56,31.37 52.58,31.37 52.58,33.53 52.32,33.53
  pour Bottom (rank 3, no thermals): 57.66,33.15 57.66,16.38 58.8,15.24 62.74,15.24 62.74,8.76 53.98,8.76 51.44,11.3 51.44,32 52.58,33.15
VCS_B_N
  Bottom 0.254: R9.1S 63.45,11.94 63.07,11.56 63.07,6.77 61.93,5.64 45.52,5.64 44.79,4.91 R11.1
VCS_B_P
  Bottom 0.254: R10.1 44.79,6.77 45.52,6.04 61.77,6.04 62.66,6.94 62.66,11.56 62.28,11.94 R9.2S
VSENSE  (via drill 0.35)
  Top 0.254: U1.15 34.29,15.56 34.29,17.27 v35.18,18.16
  Bottom 0.254: R13.1 R14.2 C17.2 40.73,18.88 40.01,18.16 v35.18,18.16

### Text on the board
tPlace: DBG | beta | MD201x | CONF | 0 | 1 | 2 | 3 | 4 | by YskHara / 4th, Feb. '19.
tNames: TERM | OPEN | CAN / TERM. | OUT+ | RST | CONF | OUT- | ENC | D-IN
bNames: VM+ | VM- | 3V3 | GND | DIO | 5V | CLK | TX | GND | RX | GND | 5V | ENC_A | ENC_B | GND | 5V | DIN_A | DIN_B